# EasyEDA schematic SCH_CapibaraZero_Navigation_Board_2024-04-09.json

## Sheets
1 CapibaraZero_Main_Scheme: TITLE: CapibaraZero_ESP32-S3; REV: 1.0; Date: 2024-04-09; Sheet: 1/1; Drawn By: Andrea Canale; Company: CapibaraZero
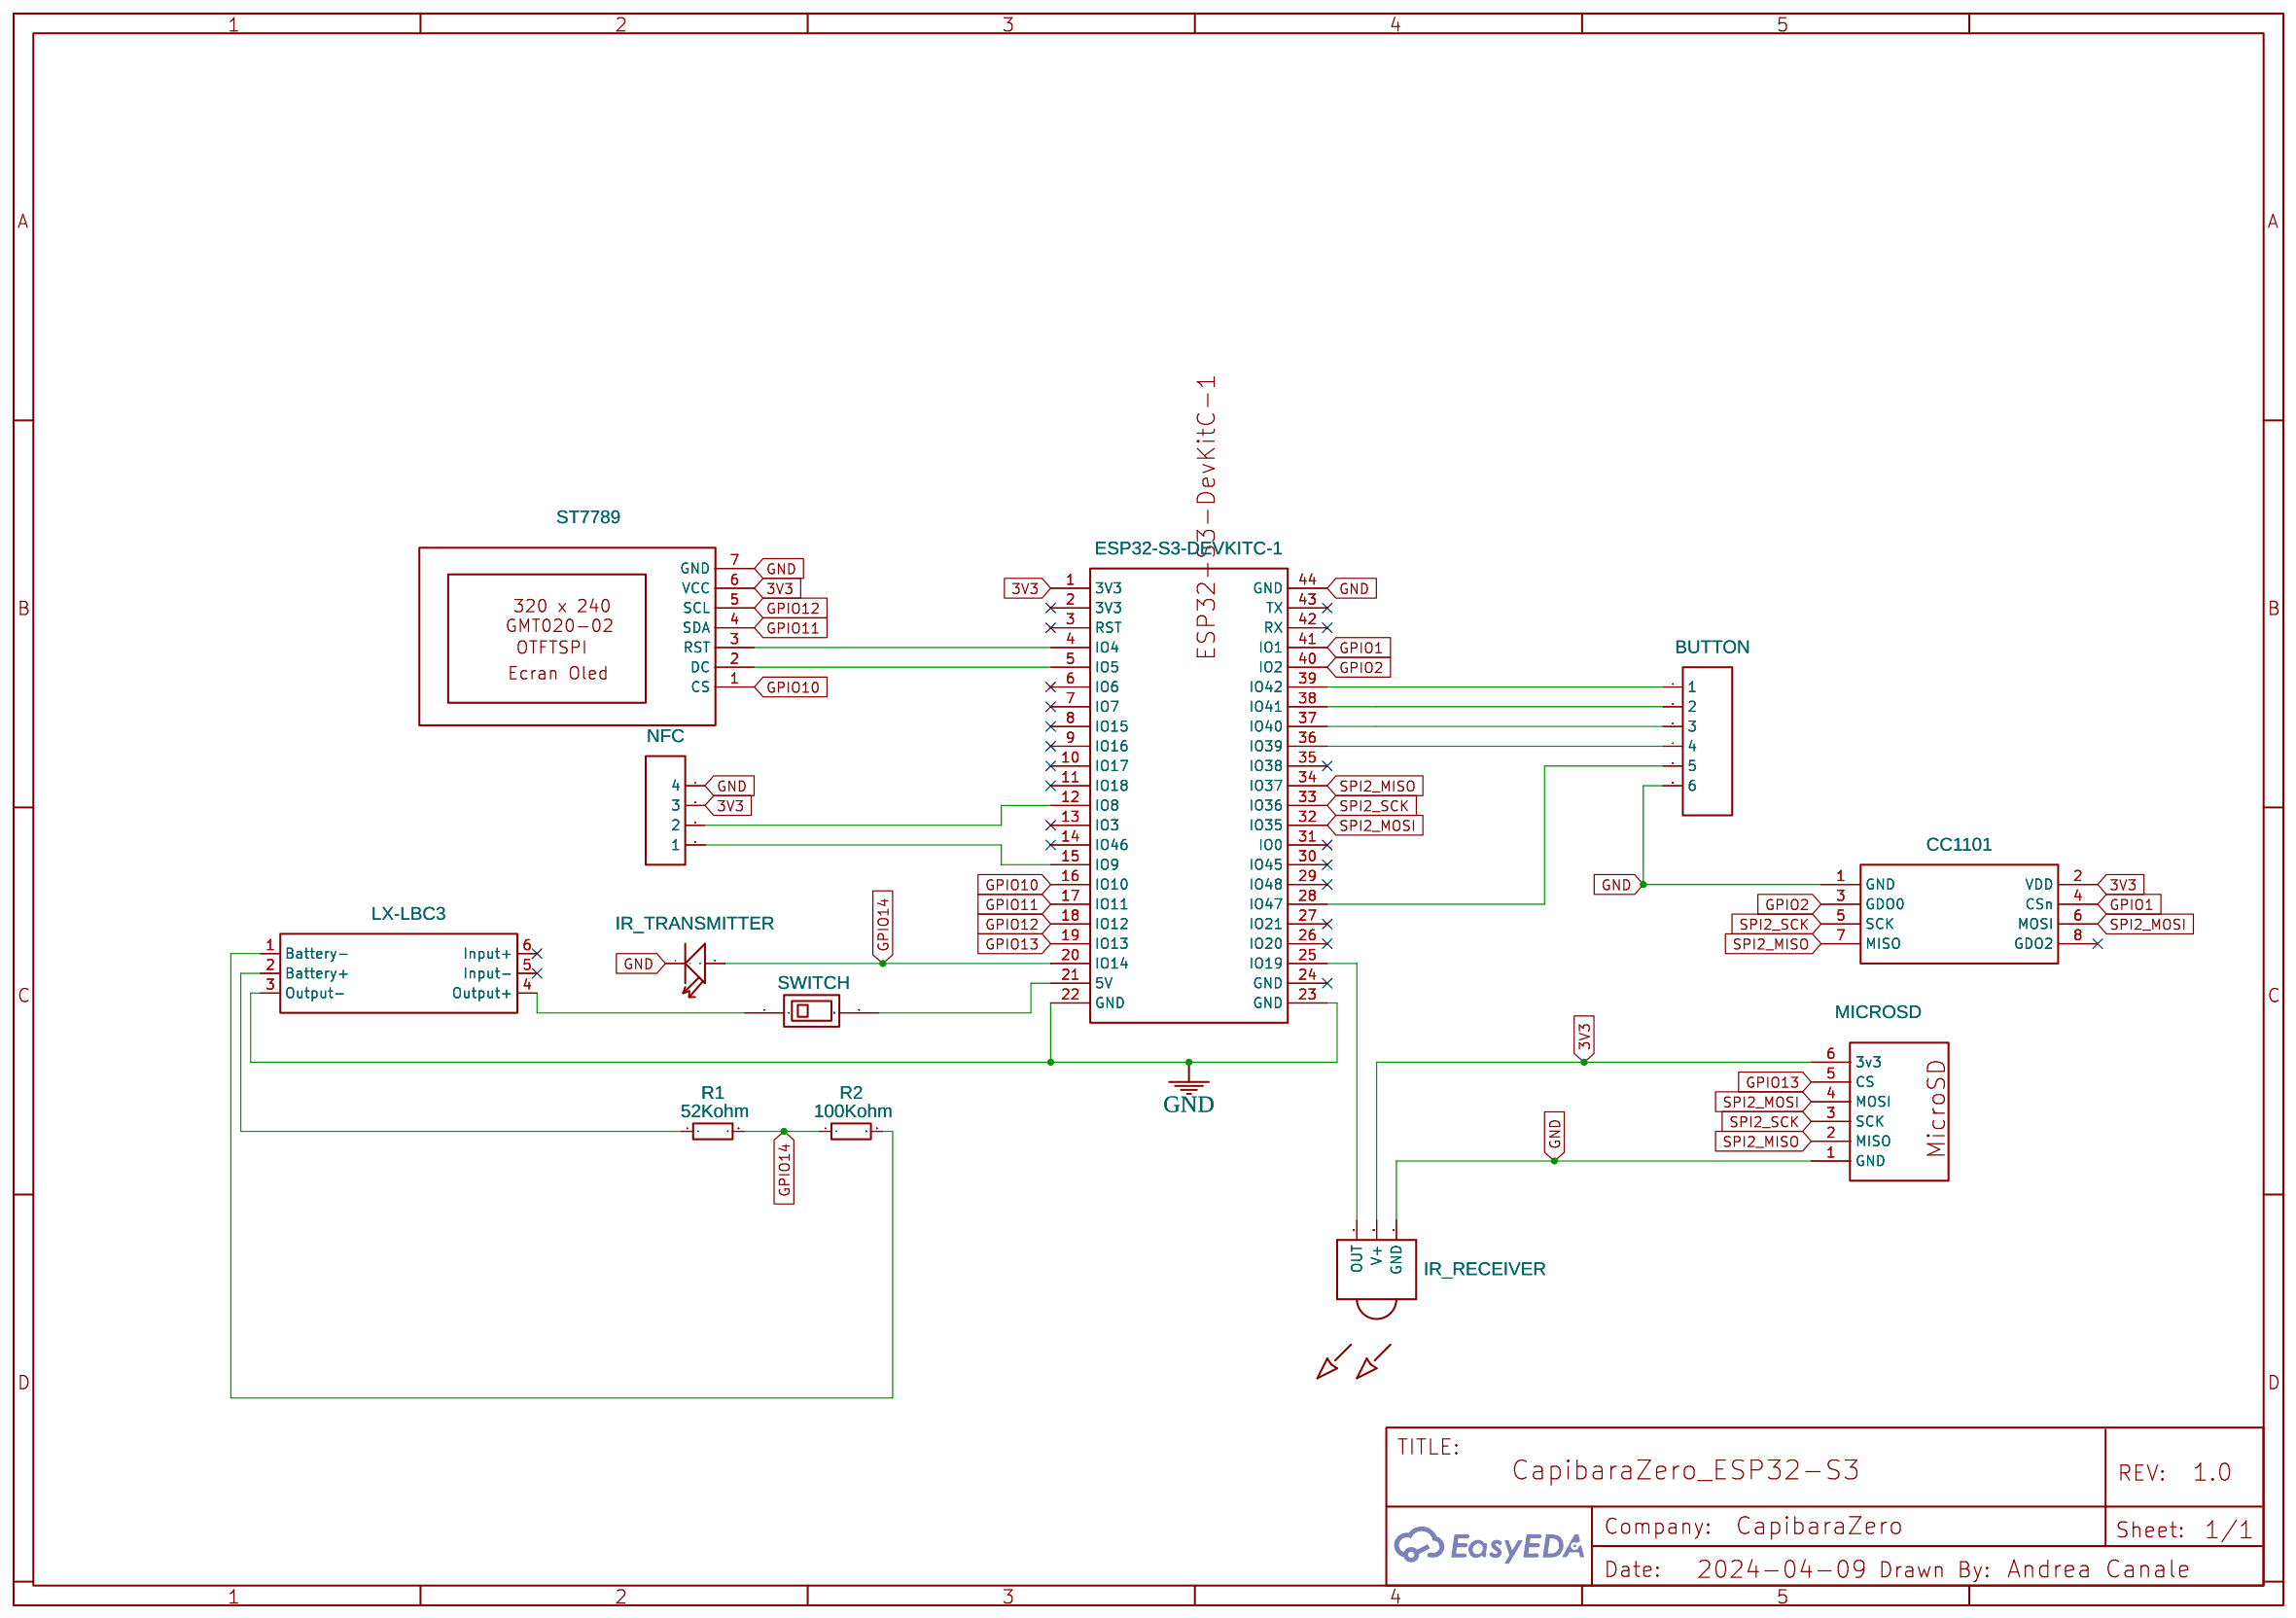
[diagram p0: CapibaraZero_Main_Scheme]
2 Navigation board: TITLE: Navigation Board; Date: 2024-02-09; Drawn By: vivanco11.ac; Company: Your Company
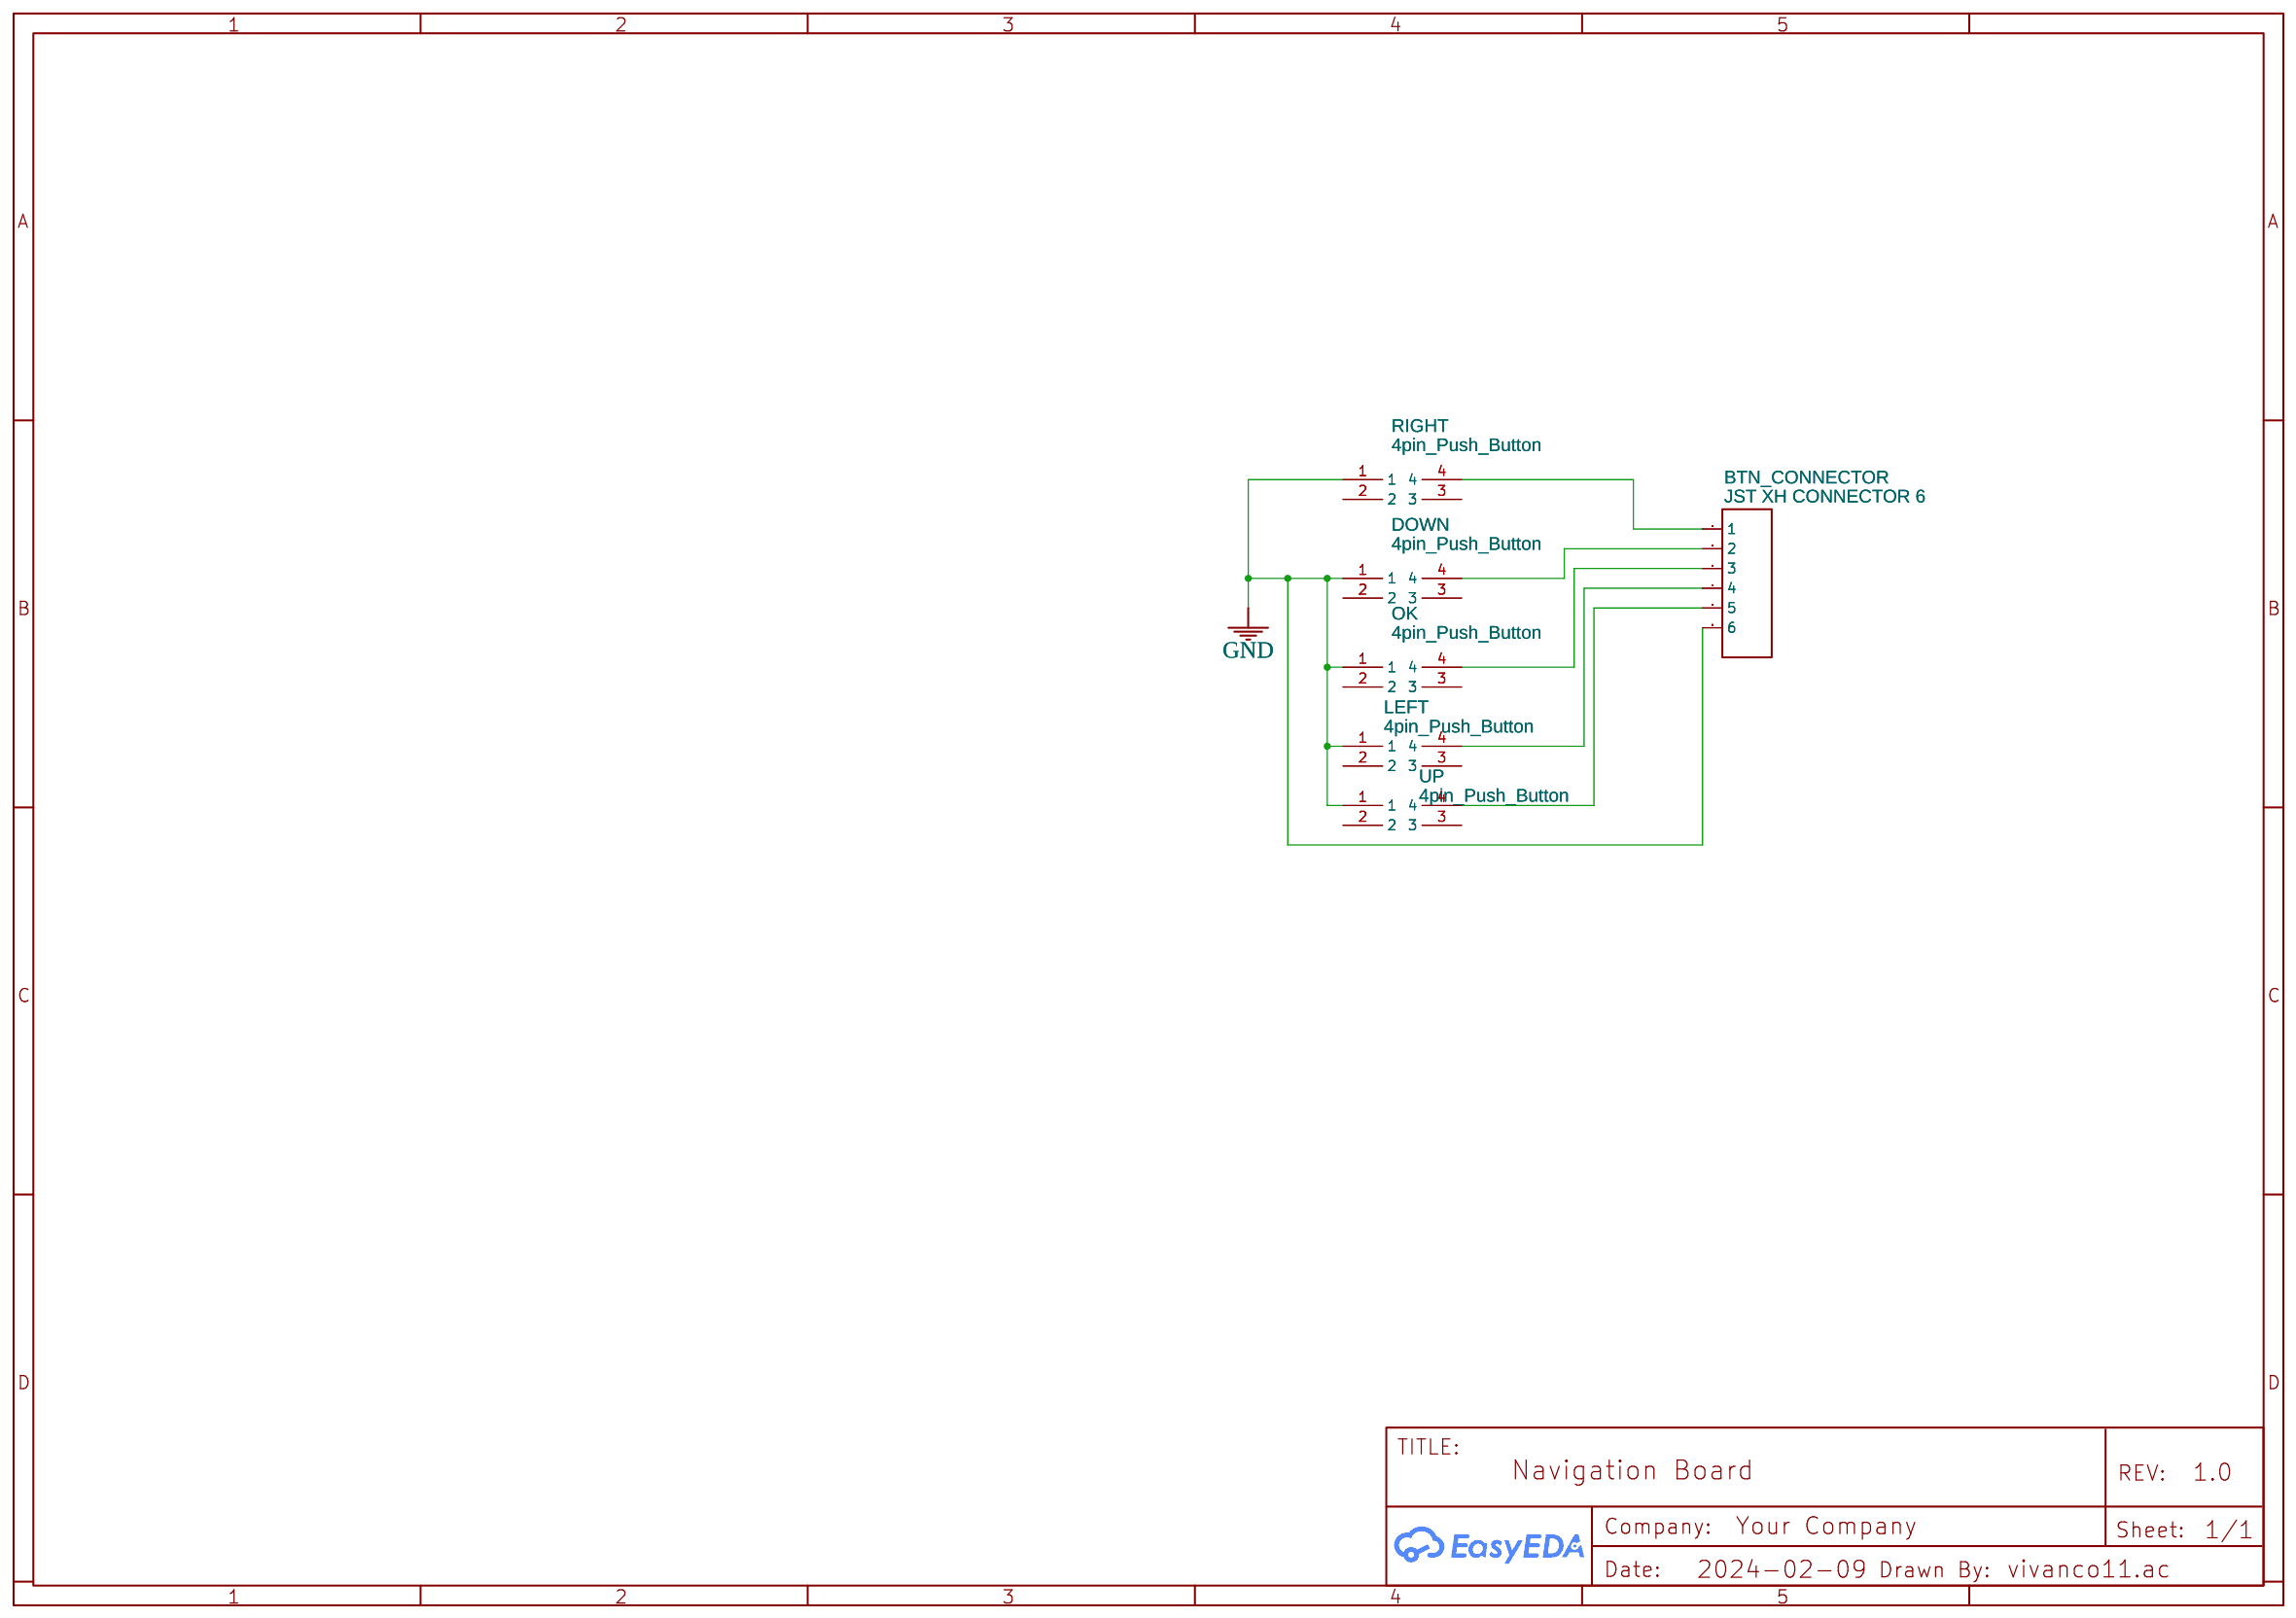
[diagram p1: Navigation board]

## Parts
sheet CapibaraZero_Main_Scheme
BUTTON  BTN Connector  [JST XH 6 PIN]
CC1101  CC1101 E07-M1101D  [CC1101V2]
ESP32-S3-DEVKITC-1  ESP32-S3-DevKitC-1 development board  [ESP32-S3-DEVKITC-1 DEVELOPMENT BOARD]
IR_RECEIVER  IR RECEIVER  [TSOP18XX]
IR_TRANSMITTER  DIP-IR-LED-940NM(2P-D5MM)  [LED2-2.54-D5.0MM]
LX-LBC3  LX-LBC3  [LX-LBC3]
MICROSD  MicroSDSPI  [MICROSD SOCKET]
NFC  NFC Connector  [JST_XH_4X2.54MM]
R1  52Kohm  [RESISTOR]
R2  100Kohm  [RESISTOR]
ST7789  ST7789_Display_320x240_SPI  [2.0 TFT SPI-MUS BARETTE]
SWITCH  1 Pole DIP switch  [1 POSITION DIP SWITCH]
sheet Navigation board
BTN_CONNECTOR  JST XH CONNECTOR 6  [JST XH 6 PIN]
DOWN  4pin_Push_Button  [PUSH BUTTON 4 PIN DIP]
LEFT  4pin_Push_Button  [PUSH BUTTON 4 PIN DIP]
OK  4pin_Push_Button  [PUSH BUTTON 4 PIN DIP]
RIGHT  4pin_Push_Button  [PUSH BUTTON 4 PIN DIP]
UP  4pin_Push_Button  [PUSH BUTTON 4 PIN DIP]

## Library data of the parts
BTN_CONNECTOR BUTTON = JST XH CONNECTOR 6: Manufacturer Part: JST_XH CONNECTOR; link: https://nl.aliexpress.com/item/50-sets-Kit-in-doos-2-p-3-p-4-pin-2-54mm-Pitch-Terminal-Behuizing/32681086028.html?spm=a2g0s.9042311.0.0.I0g15Z; Contributor: vivanco11.ac
CC1101 = CC1101 E07-M1101D: Manufacturer: Chengdu Ebyte Electronic Technology Co., Ltd.; Manufacturer Part: E07-M1101D-SMA; Supplier: Ebyte; Supplier Part: E07-M1101D-SMA; link: http://www.ebyte.com/en/downpdf.aspx?id=165; Contributor: vivanco11.ac; Package Display: No
ESP32-S3-DEVKITC-1 = ESP32-S3-DevKitC-1 development board: Manufacturer: Espressif; Supplier: Espressif; Contributor: vivanco11.ac
IR_RECEIVER = IR TRANSMITTER: sourceId: vOawSeXH3; Contributor: vivanco11.ac
IR_TRANSMITTER = DIP-IR-LED-940NM(2P-D5MM): DIP IR LED 940nm; Supplier Part: 304090159; Supplier: SeeedStudio; Manufacturer Part: IR523B-W60W1; sourceId: iIBTN5nFX; Contributor: vivanco11.ac
LX-LBC3 = LX-LBC3: Contributor: vivanco11.ac
MICROSD = MicroSDSPI: catid: 20; Contributor: vivanco11.ac; sim: true
NFC = JST XH CONNECTOR 4: Manufacturer Part: JST_XH CONNECTOR; link: https://nl.aliexpress.com/item/50-sets-Kit-in-doos-2-p-3-p-4-pin-2-54mm-Pitch-Terminal-Behuizing/32681086028.html?spm=a2g0s.9042311.0.0.I0g15Z; Contributor: vivanco11.ac
R1 R2 = Resistor Normal: Supplier: LCSC; Supplier Part: X16151710; Manufacturer: ResistorToday; Manufacturer Part: EWWR0001J20R0T9; Contributor: vivanco11.ac
ST7789 = ST7789_Display_320x240_SPI: Contributor: vivanco11.ac; Package Display: No
SWITCH = 1 Pole DIP switch: Contributor: vivanco11.ac
DOWN LEFT OK RIGHT UP = 4pin_Push_Button: Contributor: vivanco11.ac

## Nets
3V3: CC1101.2(VDD) ESP32-S3-DEVKITC-1.1(3V3) IR_RECEIVER.VCC(V+) MICROSD.6(3v3) NFC.3 ST7789.6(VCC)
GND: BTN_CONNECTOR.6 BUTTON.6 CC1101.1(GND) DOWN.1 ESP32-S3-DEVKITC-1.22(GND) ESP32-S3-DEVKITC-1.23(GND) ESP32-S3-DEVKITC-1.44(GND) IR_RECEIVER.GND IR_TRANSMITTER.- LEFT.1 LX-LBC3.3(Output-) MICROSD.1(GND) NFC.4 OK.1 RIGHT.1 ST7789.7(GND) UP.1
GPIO1: CC1101.4(CSn) ESP32-S3-DEVKITC-1.41(IO1)
GPIO2: CC1101.3(GDO0) ESP32-S3-DEVKITC-1.40(IO2)
GPIO10: ESP32-S3-DEVKITC-1.16(IO10) ST7789.1(CS)
GPIO11: ESP32-S3-DEVKITC-1.17(IO11) ST7789.4(SDA)
GPIO12: ESP32-S3-DEVKITC-1.18(IO12) ST7789.5(SCL)
GPIO13: ESP32-S3-DEVKITC-1.19(IO13) MICROSD.5(CS)
GPIO14: ESP32-S3-DEVKITC-1.20(IO14) IR_TRANSMITTER.+ R1.2 R2.1
SPI2_MISO: CC1101.7(MISO) ESP32-S3-DEVKITC-1.34(IO37) MICROSD.2(MISO)
SPI2_MOSI: CC1101.6(MOSI) ESP32-S3-DEVKITC-1.32(IO35) MICROSD.4(MOSI)
SPI2_SCK: CC1101.5(SCK) ESP32-S3-DEVKITC-1.33(IO36) MICROSD.3(SCK)
Net-(BTN_CONNECTOR-1): BTN_CONNECTOR.1 RIGHT.4
Net-(BTN_CONNECTOR-2): BTN_CONNECTOR.2 DOWN.4
Net-(BTN_CONNECTOR-3): BTN_CONNECTOR.3 OK.4
Net-(BTN_CONNECTOR-4): BTN_CONNECTOR.4 LEFT.4
Net-(BTN_CONNECTOR-5): BTN_CONNECTOR.5 UP.4
Net-(BUTTON-1): BUTTON.1 ESP32-S3-DEVKITC-1.39(IO42)
Net-(BUTTON-2): BUTTON.2 ESP32-S3-DEVKITC-1.38(IO41)
Net-(BUTTON-3): BUTTON.3 ESP32-S3-DEVKITC-1.37(IO40)
Net-(BUTTON-4): BUTTON.4 ESP32-S3-DEVKITC-1.36(IO39)
Net-(BUTTON-5): BUTTON.5 ESP32-S3-DEVKITC-1.28(IO47)
Net-(ESP32-S3-DEVKITC-1-4): ESP32-S3-DEVKITC-1.4(IO4) ST7789.3(RST)
Net-(ESP32-S3-DEVKITC-1-5): ESP32-S3-DEVKITC-1.5(IO5) ST7789.2(DC)
Net-(ESP32-S3-DEVKITC-1-12): ESP32-S3-DEVKITC-1.12(IO8) NFC.2
Net-(ESP32-S3-DEVKITC-1-15): ESP32-S3-DEVKITC-1.15(IO9) NFC.1
Net-(ESP32-S3-DEVKITC-1-21): ESP32-S3-DEVKITC-1.21(5V) SWITCH.2(OUT)
Net-(ESP32-S3-DEVKITC-1-25): ESP32-S3-DEVKITC-1.25(IO19) IR_RECEIVER.OUT
Net-(LX-LBC3-1): LX-LBC3.1(Battery-) R2.2
Net-(LX-LBC3-2): LX-LBC3.2(Battery+) R1.1
Net-(LX-LBC3-4): LX-LBC3.4(Output+) SWITCH.1(IN)

Not connected (* = marked no-connect by the designer): CC1101 8(GDO2)*; DOWN 2 3; ESP32-S3-DEVKITC-1 2(3V3)* 3(RST)* 6(IO6)* 7(IO7)* 8(IO15)* 9(IO16)* 10(IO17)* 11(IO18)* 13(IO3)* 14(IO46)* 24(GND)* 26(IO20)* 27(IO21)* 29(IO48)* 30(IO45)* 31(IO0)* 35(IO38)* 42(RX)* 43(TX)*; LEFT 2 3; LX-LBC3 5(Input-)* 6(Input+)*; OK 2 3; RIGHT 2 3; UP 2 3
